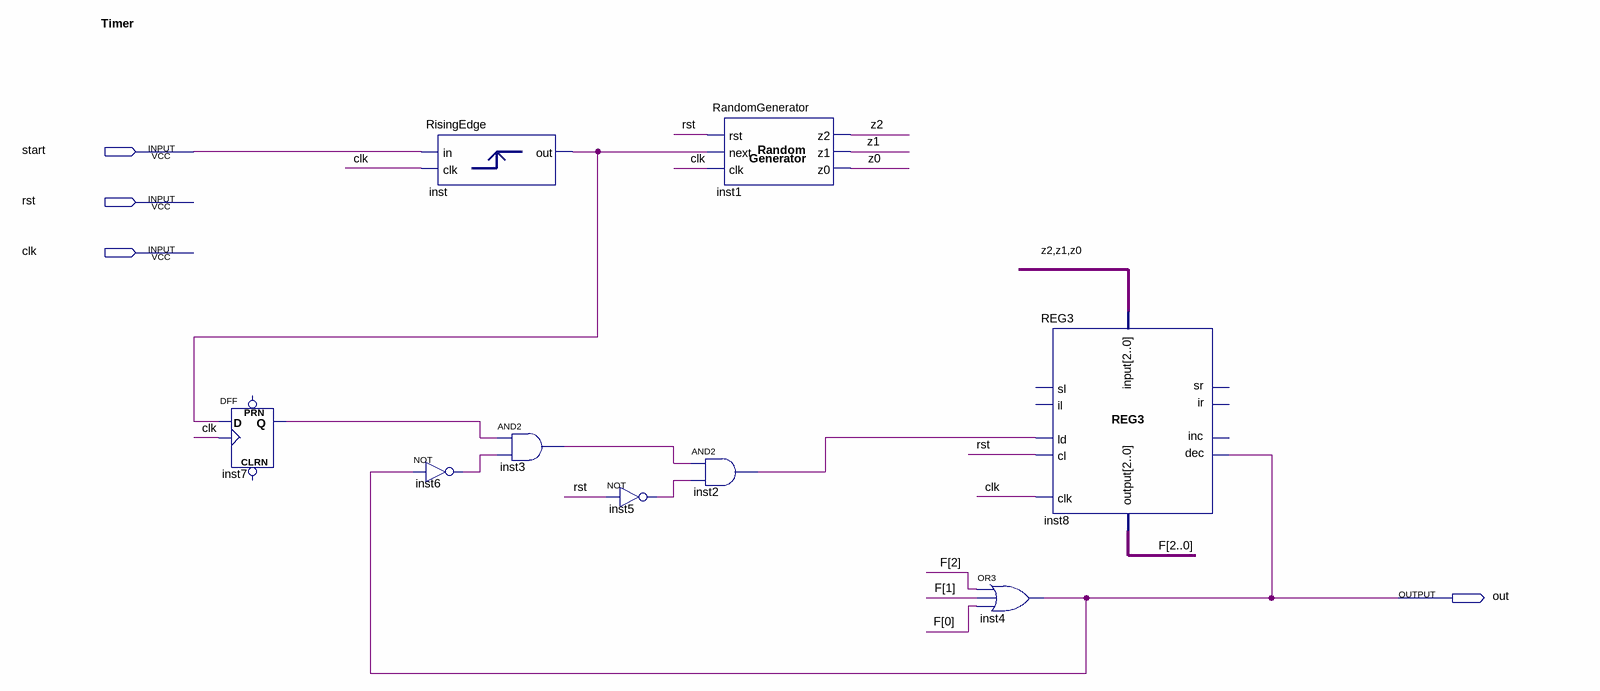
[diagram p0: schematic sheet]
// Quartus schematic Timer.bdf as structural Verilog: 9 symbols, 4 pins
module Timer (
  input  start,
  input  rst,
  input  clk,
  output out
);

  wire inst2_out, inst3_out, inst5_out, inst6_out, inst7_q, inst_output, z0, z1, z2;
  wire [2:0] F;

  DFF inst7 (.CLK(clk), .D(inst_output), .Q(inst7_q));  // open: CLRN, PRN
  RisingEdge inst (.clk(clk), .\input (start), .\output (inst_output));
  not inst6 (inst6_out, out);
  and inst3 (inst3_out, inst7_q, inst6_out);
  not inst5 (inst5_out, rst);
  and inst2 (inst2_out, inst3_out, inst5_out);
  RandomGenerator inst1 (.NXT(inst_output), .RST(rst), .CLK(clk), .Z2(z2), .Z1(z1), .Z0(z0));
  or inst4 (out, F[2], F[1], F[0]);
  REG3 inst8 (
    .clk(clk), .ld(inst2_out), .\input ({z2, z1, z0}), .dec(out), .cl(rst), .\output (F));  // open: sr, ir, sl, il, inc

  // Notes on the sheet:
  //   Timer
endmodule
